# Altium project PCB_Project1.PrjPCB
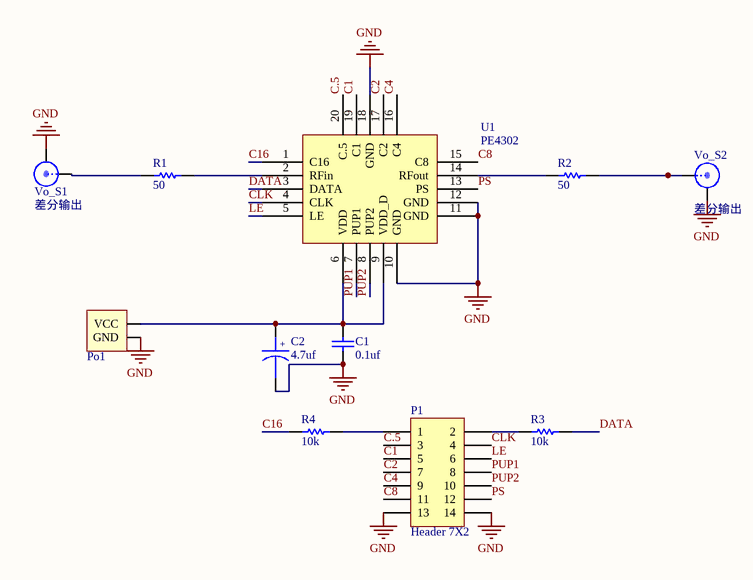
[diagram p0: Sheet1.SchDoc]
1 sheet, 11 parts. Net scope: global (net labels, ports and power ports of the same name join across sheets).
Board file: PCB1.PcbDoc

## Sheet Sheet1.SchDoc
size A4

### Parts
C1  0.1uf  [0603C]
C2  4.7uf  [7343-31 TYPE D]
P1  Header 7X2  [HDR2X7]
Po1  Power_2Port  [Power_S_2Port]  (value not drawn)
R1  50  [0805]
R2  50  [0805]
R3  10k  [0603R]
R4  10k  [0603R]
U1  PE4302  [LC-QFN-20_4x4x05P]
Vo_S1  差分输出  [SMA-LYING]
Vo_S2  差分输出  [SMA-LYING]

### Nets
GND: C1.1 C2.2 P1.13 P1.14 Po1.2(GND) U1.10(GND) U1.11(GND) U1.12(GND) U1.18(GND) Vo_S1.1 Vo_S2.1
C1: P1.5 U1.19(C1)
C2: P1.7 U1.17(C2)
C4: P1.9 U1.16(C4)
C8: P1.11 U1.15(C8)
C16: R4.1 U1.1(C16)
C.5: P1.3 U1.20(C.5)
CLK: P1.4 U1.4(CLK)
DATA: R3.2 U1.3(DATA)
LE: P1.6 U1.5(LE)
PS: P1.12 U1.13(PS)
PUP1: P1.8 U1.7(PUP1)
PUP2: P1.10 U1.8(PUP2)
NetC1_2: C1.2 C2.1 Po1.1(VCC) U1.6(VDD) U1.9(VDD_D)
NetP1_1: P1.1 R4.2
NetP1_2: P1.2 R3.1
NetR1_1: R1.1 Vo_S1.0
NetR1_2: R1.2 U1.2(RFin)
NetR2_1: R2.1 U1.14(RFout)
NetR2_2: R2.2 Vo_S2.0

### Notes on the sheet
- (in symbol Tantalium Cap) +
- (in symbol Cap) +

### Library data of the parts
C1 = Cap
C2 = Tantalium Cap
P1 = Header 7X2: Header, 7-Pin, Dual row; LatestRevisionDate: 17-Jul-2002; LatestRevisionNote: Re-released for DXP Platform.; Publisher: Altium Limited
R1-R4 = Res
Vo_S1 Vo_S2 = SMA